# EAGLE schematic Charger Interlock (EAGLE 8.4.1)
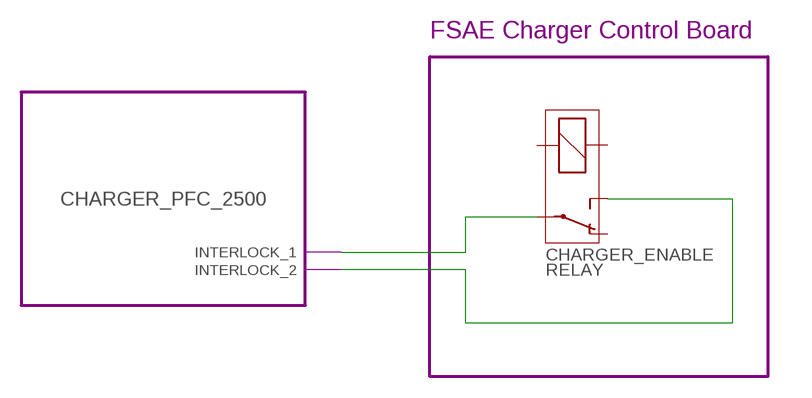
[diagram p0: schematic, sheet 1]

## Parts
CHARGER_ENABLE  RELAY  (no package)

## Module instances
CHARGER_PFC_2500 = CHARGER

## Nets
N$1: CHARGER_ENABLE.P ; port CHARGER_PFC_2500.INTERLOCK_1
N$2: CHARGER_ENABLE.S ; port CHARGER_PFC_2500.INTERLOCK_2
Unconnected: CHARGER_ENABLE.1 CHARGER_ENABLE.2 CHARGER_ENABLE.O

## Notes on the sheet
- FSAE Charger Control Board

## Library data of the parts
CHARGER_ENABLE = HyTechSymbols:RELAY: RELAY 1 x switch

## Module CHARGER
Ports: INTERLOCK_1(io) INTERLOCK_2(io)

### Library data of the parts